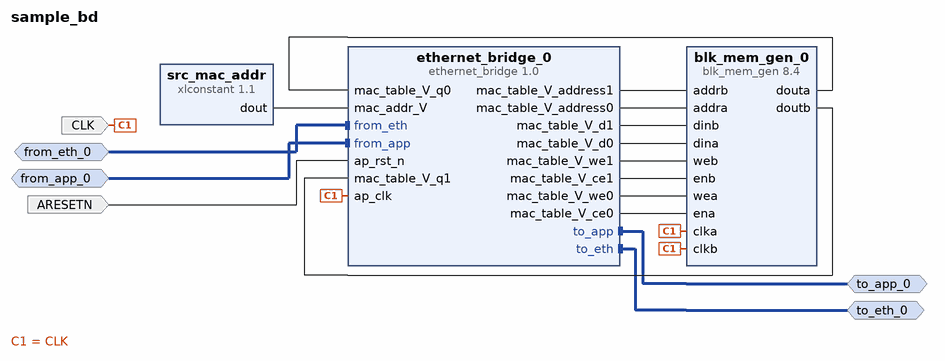
[diagram p0: block diagram of the top level]
# Vivado block design sample_bd, xcku115-flva1517-2-e, Vivado 2018.1
create_bd_design sample_bd

create_bd_intf_port -mode Slave -vlnv xilinx.com:interface:axis_rtl:1.0 from_eth_0
set_property -dict [list \
  CONFIG.TDATA_NUM_BYTES 8 \
  CONFIG.TDEST_WIDTH 0 \
  CONFIG.TID_WIDTH 0 \
  CONFIG.TUSER_WIDTH 0 \
  CONFIG.HAS_TREADY 1 \
  CONFIG.HAS_TSTRB 0 \
  CONFIG.HAS_TKEEP 1 \
  CONFIG.HAS_TLAST 1 \
  CONFIG.LAYERED_METADATA {xilinx.com:interface:datatypes:1.0 {TDATA {datatype {name {attribs {resolve_type immediate dependency {} format string minimum {} maximum {}} value {}} bitwidth {attribs {resolve_type immediate dependency {} format long minimum {} maximum {}} value 64} bitoffset {attribs {resolve_type immediate dependency {} format long minimum {} maximum {}} value 0} integer {signed {attribs {resolve_type immediate dependency {} format bool minimum {} maximum {}} value true}}}}}} \
] [get_bd_intf_ports from_eth_0]
create_bd_intf_port -mode Slave -vlnv xilinx.com:interface:axis_rtl:1.0 from_app_0
set_property -dict [list \
  CONFIG.TDATA_NUM_BYTES 8 \
  CONFIG.TDEST_WIDTH 8 \
  CONFIG.TID_WIDTH 0 \
  CONFIG.TUSER_WIDTH 0 \
  CONFIG.HAS_TREADY 1 \
  CONFIG.HAS_TSTRB 0 \
  CONFIG.HAS_TKEEP 1 \
  CONFIG.HAS_TLAST 1 \
  CONFIG.LAYERED_METADATA {xilinx.com:interface:datatypes:1.0 {TDATA {datatype {name {attribs {resolve_type immediate dependency {} format string minimum {} maximum {}} value {}} bitwidth {attribs {resolve_type immediate dependency {} format long minimum {} maximum {}} value 64} bitoffset {attribs {resolve_type immediate dependency {} format long minimum {} maximum {}} value 0} integer {signed {attribs {resolve_type immediate dependency {} format bool minimum {} maximum {}} value true}}}}}} \
] [get_bd_intf_ports from_app_0]
create_bd_intf_port -mode Master -vlnv xilinx.com:interface:axis_rtl:1.0 to_app_0
create_bd_intf_port -mode Master -vlnv xilinx.com:interface:axis_rtl:1.0 to_eth_0
create_bd_port -dir I -type clk CLK
set_property -dict {CONFIG.FREQ_HZ 156250000} [get_bd_ports CLK]
create_bd_port -dir I -type rst ARESETN
set_property -dict {CONFIG.POLARITY ACTIVE_HIGH} [get_bd_ports ARESETN]

create_bd_cell -type ip -vlnv xilinx.com:ip:xlconstant:1.1 src_mac_addr
set_property -dict {CONFIG.CONST_WIDTH 48} [get_bd_cells src_mac_addr]
create_bd_cell -type ip -vlnv xilinx.com:ip:blk_mem_gen:8.4 blk_mem_gen_0
set_property -dict [list \
  CONFIG.Memory_Type True_Dual_Port_RAM \
  CONFIG.Enable_32bit_Address false \
  CONFIG.Use_Byte_Write_Enable false \
  CONFIG.Write_Width_A 48 \
  CONFIG.Write_Depth_A 256 \
  CONFIG.Read_Width_A 48 \
  CONFIG.Enable_A Use_ENA_Pin \
  CONFIG.Write_Width_B 48 \
  CONFIG.Read_Width_B 48 \
  CONFIG.Enable_B Use_ENB_Pin \
  CONFIG.Register_PortA_Output_of_Memory_Primitives true \
  CONFIG.Register_PortB_Output_of_Memory_Primitives true \
  CONFIG.Use_RSTA_Pin false \
  CONFIG.Use_RSTB_Pin false \
  CONFIG.Port_A_Write_Rate 50 \
  CONFIG.Port_B_Clock 100 \
  CONFIG.Port_B_Write_Rate 50 \
  CONFIG.Port_B_Enable_Rate 100 \
  CONFIG.use_bram_block Stand_Alone \
] [get_bd_cells blk_mem_gen_0]
create_bd_cell -type ip -vlnv xilinx.com:hls:ethernet_bridge:1.0 ethernet_bridge_0

# ---- connections ----

connect_bd_intf_net -intf_net from_eth_0_1 [get_bd_intf_ports from_eth_0] [get_bd_intf_pins ethernet_bridge_0/from_eth]
connect_bd_intf_net -intf_net from_app_0_1 [get_bd_intf_ports from_app_0] [get_bd_intf_pins ethernet_bridge_0/from_app]
connect_bd_intf_net [get_bd_intf_ports to_app_0] [get_bd_intf_pins ethernet_bridge_0/to_app]
connect_bd_intf_net [get_bd_intf_ports to_eth_0] [get_bd_intf_pins ethernet_bridge_0/to_eth]
connect_bd_net [get_bd_ports CLK] [get_bd_pins blk_mem_gen_0/clka] [get_bd_pins blk_mem_gen_0/clkb] [get_bd_pins ethernet_bridge_0/ap_clk]
connect_bd_net [get_bd_pins blk_mem_gen_0/douta] [get_bd_pins ethernet_bridge_0/mac_table_V_q0]
connect_bd_net [get_bd_pins src_mac_addr/dout] [get_bd_pins ethernet_bridge_0/mac_addr_V]
connect_bd_net [get_bd_pins blk_mem_gen_0/doutb] [get_bd_pins ethernet_bridge_0/mac_table_V_q1]
connect_bd_net [get_bd_pins ethernet_bridge_0/mac_table_V_address1] [get_bd_pins blk_mem_gen_0/addrb]
connect_bd_net [get_bd_pins ethernet_bridge_0/mac_table_V_address0] [get_bd_pins blk_mem_gen_0/addra]
connect_bd_net [get_bd_pins ethernet_bridge_0/mac_table_V_d1] [get_bd_pins blk_mem_gen_0/dinb]
connect_bd_net [get_bd_pins ethernet_bridge_0/mac_table_V_d0] [get_bd_pins blk_mem_gen_0/dina]
connect_bd_net [get_bd_pins ethernet_bridge_0/mac_table_V_we1] [get_bd_pins blk_mem_gen_0/web]
connect_bd_net [get_bd_pins ethernet_bridge_0/mac_table_V_ce1] [get_bd_pins blk_mem_gen_0/enb]
connect_bd_net [get_bd_pins ethernet_bridge_0/mac_table_V_we0] [get_bd_pins blk_mem_gen_0/wea]
connect_bd_net [get_bd_pins ethernet_bridge_0/mac_table_V_ce0] [get_bd_pins blk_mem_gen_0/ena]
connect_bd_net [get_bd_ports ARESETN] [get_bd_pins ethernet_bridge_0/ap_rst_n]

validate_bd_design
save_bd_design
